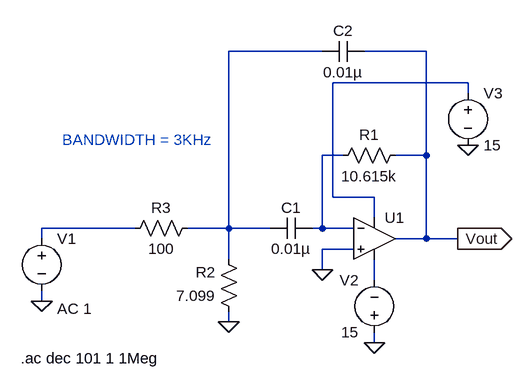
[diagram p0: schematic band_pass_filter.asc]
band_pass_filter.asc, the LTspice schematic file:
Version 4
SHEET 1 880 680
WIRE 192 -80 48 -80
WIRE 352 -80 256 -80
WIRE 416 -32 208 -32
WIRE 416 -16 416 -32
WIRE 224 80 192 80
WIRE 352 80 352 -80
WIRE 352 80 304 80
WIRE 208 144 208 -32
WIRE 272 144 208 144
WIRE 272 176 272 144
WIRE -96 192 -240 192
WIRE 48 192 48 -80
WIRE 48 192 -16 192
WIRE 112 192 48 192
WIRE 192 192 192 80
WIRE 192 192 176 192
WIRE 240 192 192 192
WIRE -240 208 -240 192
WIRE 352 208 352 80
WIRE 352 208 304 208
WIRE 400 208 352 208
WIRE 240 224 192 224
WIRE 48 240 48 192
WIRE 192 256 192 224
WIRE 272 272 272 240
WIRE -240 304 -240 288
WIRE 48 336 48 320
WIRE 272 368 272 352
FLAG -240 304 0
FLAG 192 256 0
FLAG 272 368 0
FLAG 416 64 0
FLAG 48 336 0
FLAG 400 208 Vout
IOPIN 400 208 Out
SYMBOL OpAmps\\UniversalOpamp2 272 208 R0
SYMATTR InstName U1
SYMBOL res 320 64 R90
WINDOW 0 0 56 VBottom 2
WINDOW 3 32 56 VTop 2
SYMATTR InstName R1
SYMATTR Value 10.615k
SYMBOL res 64 336 R180
WINDOW 0 36 76 Left 2
WINDOW 3 36 40 Left 2
SYMATTR InstName R2
SYMATTR Value 7.099
SYMBOL res -112 208 R270
WINDOW 0 32 56 VTop 2
WINDOW 3 0 56 VBottom 2
SYMATTR InstName R3
SYMATTR Value 100
SYMBOL cap 176 176 R90
WINDOW 0 0 32 VBottom 2
WINDOW 3 32 32 VTop 2
SYMATTR InstName C1
SYMATTR Value 0.01µ
SYMBOL cap 256 -96 R90
WINDOW 0 0 32 VBottom 2
WINDOW 3 32 32 VTop 2
SYMATTR InstName C2
SYMATTR Value 0.01µ
SYMBOL voltage -240 192 R0
WINDOW 123 24 124 Left 2
WINDOW 39 0 0 Left 0
SYMATTR Value2 AC 1
SYMATTR InstName V1
SYMATTR Value ""
SYMBOL voltage 272 368 R180
WINDOW 0 24 96 Left 2
WINDOW 3 24 16 Left 2
WINDOW 123 0 0 Left 0
WINDOW 39 0 0 Left 0
SYMATTR InstName V2
SYMATTR Value 15
SYMBOL voltage 416 -32 R0
WINDOW 123 0 0 Left 0
WINDOW 39 0 0 Left 0
SYMATTR InstName V3
SYMATTR Value 15
TEXT -272 392 Left 2 !.ac dec 101 1 1Meg
TEXT -208 56 Left 2 ;BANDWIDTH = 3KHz

The netlist it stands for:
* band_pass_filter.asc
XU1 0 N003 N002 N005 Vout level.2 Avol=1Meg GBW=10Meg Slew=10Meg ilimit=25m rail=0 Vos=0 phimargin=45 en=0 enk=0 in=0 ink=0 Rin=500Meg  ; pins IN+ IN- V+ V- OUT
R1 Vout N003 10.615k
R2 0 N001 7.099
R3 N004 N001 100
C1 N003 N001 0.01µ
C2 Vout N001 0.01µ
V1 N004 0 AC 1
V2 0 N005 15
V3 N002 0 15
.ac dec 101 1 1Meg
* BANDWIDTH = 3KHz
.lib UniversalOpamps2.sub
.backanno
.end